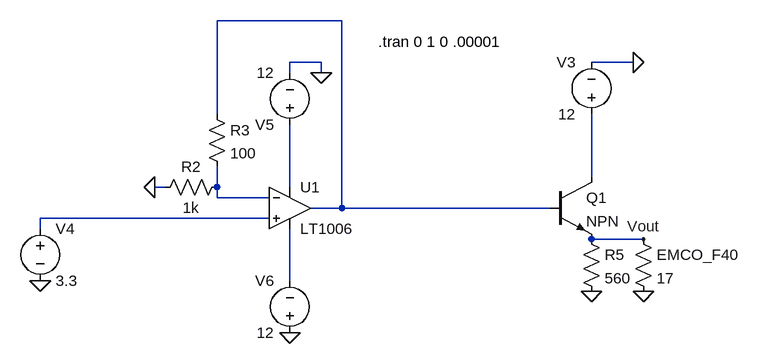
[diagram p0: schematic HV system.asc]
HV system.asc, the LTspice schematic file:
Version 4
SHEET 1 880 680
WIRE 0 -224 -192 -224
WIRE -32 -160 -80 -160
WIRE 448 -160 384 -160
WIRE -80 -144 -80 -160
WIRE -32 -144 -32 -160
WIRE -192 -80 -192 -224
WIRE 384 16 384 -80
WIRE -272 32 -288 32
WIRE -192 32 -192 0
WIRE -80 32 -80 -64
WIRE -192 48 -192 32
WIRE -112 48 -192 48
WIRE 0 64 0 -224
WIRE 0 64 -48 64
WIRE 320 64 0 64
WIRE -112 80 -464 80
WIRE -464 96 -464 80
WIRE 464 112 384 112
WIRE -80 176 -80 96
FLAG -464 176 0
FLAG -80 256 0
FLAG -32 -144 0
FLAG 448 -160 0
FLAG 464 192 0
FLAG 384 192 0
FLAG 464 112 Vout
FLAG -288 32 0
SYMBOL npn 320 16 R0
SYMATTR InstName Q1
SYMBOL voltage 384 -64 R180
WINDOW 0 24 96 Left 2
WINDOW 3 24 16 Left 2
WINDOW 123 0 0 Left 2
WINDOW 39 0 0 Left 2
SYMATTR InstName V3
SYMATTR Value 12
SYMBOL res 448 96 R0
SYMATTR InstName EMCO_F40
SYMATTR Value 17
SYMBOL Opamps\\LT1006 -80 0 R0
SYMATTR InstName U1
SYMBOL voltage -80 -48 R180
WINDOW 123 0 0 Left 2
WINDOW 39 0 0 Left 2
SYMATTR InstName V5
SYMATTR Value 12
SYMBOL voltage -80 272 R180
WINDOW 0 24 96 Left 2
WINDOW 3 24 16 Left 2
WINDOW 123 0 0 Left 2
WINDOW 39 0 0 Left 2
SYMATTR InstName V6
SYMATTR Value 12
SYMBOL res -176 16 R90
WINDOW 0 0 56 VBottom 2
WINDOW 3 32 56 VTop 2
SYMATTR InstName R2
SYMATTR Value 1k
SYMBOL res -208 -96 R0
SYMATTR InstName R3
SYMATTR Value 100
SYMBOL res 368 96 R0
SYMATTR InstName R5
SYMATTR Value 560
SYMBOL voltage -464 80 R0
WINDOW 123 0 0 Left 2
WINDOW 39 0 0 Left 2
SYMATTR InstName V4
SYMATTR Value 3.3
TEXT 56 -192 Left 2 !.tran 0 1 0 .00001

The netlist it stands for:
* HV system.asc
Q1 N002 N001 Vout 0 NPN
V3 N002 0 12
R§EMCO_F40 Vout 0 17
XU1 N005 N003 N004 N006 N001 LT1006  ; pins In+ In- V+ V- OUT
V5 N004 0 12
V6 0 N006 12
R2 N003 0 1k
R3 N001 N003 100
R5 Vout 0 560
V4 N005 0 3.3
.model NPN NPN
.model PNP PNP
.lib standard.bjt
.tran 0 1 0 .00001
.lib LTC.lib
.backanno
.end